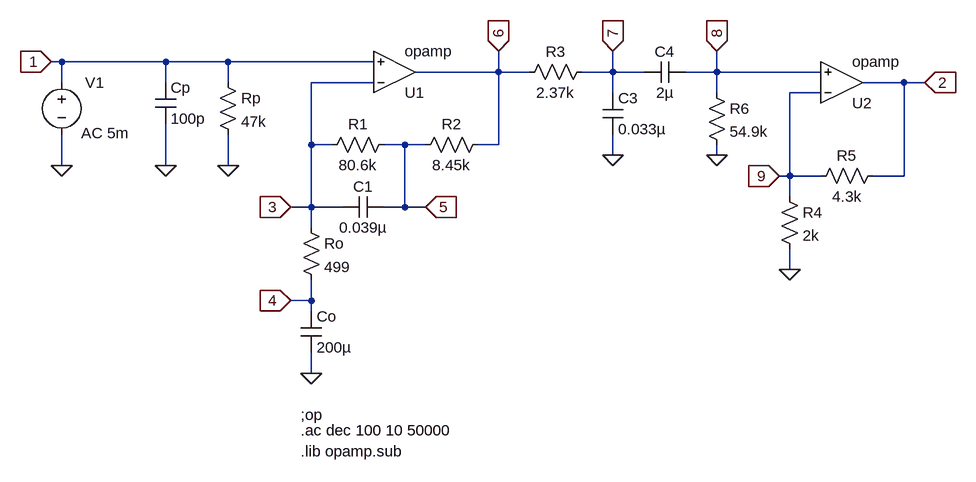
[diagram p0: schematic Two amplifier RIAA Phone Preamp v2.asc]
Two amplifier RIAA Phone Preamp v2.asc, the LTspice schematic file:
Version 4
SHEET 1 1876 1124
WIRE -272 176 -288 176
WIRE -112 176 -272 176
WIRE -16 176 -112 176
WIRE 208 176 -16 176
WIRE 400 192 400 160
WIRE 400 192 272 192
WIRE 448 192 400 192
WIRE 576 192 576 160
WIRE 576 192 528 192
WIRE 624 192 576 192
WIRE 736 192 736 160
WIRE 736 192 688 192
WIRE 896 192 736 192
WIRE -272 208 -272 176
WIRE -112 208 -112 176
WIRE -16 208 -16 176
WIRE 208 208 112 208
WIRE 1024 208 960 208
WIRE 1056 208 1024 208
WIRE 576 224 576 192
WIRE 736 224 736 192
WIRE 896 224 848 224
WIRE 112 304 112 208
WIRE 144 304 112 304
WIRE 256 304 224 304
WIRE 288 304 256 304
WIRE 400 304 400 192
WIRE 400 304 368 304
WIRE 576 320 576 288
WIRE 736 320 736 304
WIRE -272 336 -272 288
WIRE -112 336 -112 272
WIRE -16 336 -16 288
WIRE 848 352 848 224
WIRE 848 352 832 352
WIRE 896 352 848 352
WIRE 1024 352 1024 208
WIRE 1024 352 976 352
WIRE 848 384 848 352
WIRE 112 400 112 304
WIRE 112 400 80 400
WIRE 160 400 112 400
WIRE 256 400 256 304
WIRE 256 400 224 400
WIRE 288 400 256 400
WIRE 112 432 112 400
WIRE 848 496 848 464
WIRE 112 544 112 512
WIRE 112 544 80 544
WIRE 112 560 112 544
WIRE 112 656 112 624
FLAG -272 336 0
FLAG 112 656 0
FLAG -288 176 1
IOPIN -288 176 In
FLAG 80 400 3
IOPIN 80 400 In
FLAG 80 544 4
IOPIN 80 544 In
FLAG 288 400 5
IOPIN 288 400 In
FLAG 400 160 6
IOPIN 400 160 In
FLAG -112 336 0
FLAG -16 336 0
FLAG 576 320 0
FLAG 736 320 0
FLAG 848 496 0
FLAG 576 160 7
IOPIN 576 160 In
FLAG 736 160 8
IOPIN 736 160 In
FLAG 832 352 9
IOPIN 832 352 In
FLAG 1056 208 2
IOPIN 1056 208 In
SYMBOL voltage -272 192 R0
WINDOW 3 24 44 Left 2
WINDOW 123 30 94 Left 2
WINDOW 0 36 16 Left 2
WINDOW 39 0 0 Left 2
SYMATTR Value ""
SYMATTR Value2 AC 5m
SYMATTR InstName V1
SYMBOL cap 160 416 R270
WINDOW 0 32 32 VTop 2
WINDOW 3 0 32 VBottom 2
SYMATTR InstName C1
SYMATTR Value 0.039µ
SYMBOL cap 96 560 R0
SYMATTR InstName Co
SYMATTR Value 200µ
SYMBOL res 96 416 R0
SYMATTR InstName Ro
SYMATTR Value 499
SYMBOL res 432 208 R270
WINDOW 0 32 56 VTop 2
WINDOW 3 0 56 VBottom 2
SYMATTR InstName R3
SYMATTR Value 2.37k
SYMBOL res 128 320 R270
WINDOW 0 32 56 VTop 2
WINDOW 3 0 56 VBottom 2
SYMATTR InstName R1
SYMATTR Value 80.6k
SYMBOL res 272 320 R270
WINDOW 0 32 56 VTop 2
WINDOW 3 0 56 VBottom 2
SYMATTR InstName R2
SYMATTR Value 8.45k
SYMBOL cap -128 208 R0
SYMATTR InstName Cp
SYMATTR Value 100p
SYMBOL res -32 192 R0
SYMATTR InstName Rp
SYMATTR Value 47k
SYMBOL cap 560 224 R0
SYMATTR InstName C3
SYMATTR Value 0.033µ
SYMBOL cap 688 176 R90
WINDOW 0 0 32 VBottom 2
WINDOW 3 32 32 VTop 2
SYMATTR InstName C4
SYMATTR Value 2µ
SYMBOL res 720 208 R0
SYMATTR InstName R6
SYMATTR Value 54.9k
SYMBOL res 832 368 R0
SYMATTR InstName R4
SYMATTR Value 2k
SYMBOL res 992 336 R90
WINDOW 0 0 56 VBottom 2
WINDOW 3 32 56 VTop 2
SYMATTR InstName R5
SYMATTR Value 4.3k
SYMBOL OpAmps\\opamp 240 256 M180
SYMATTR InstName U1
SYMBOL OpAmps\\opamp 928 272 M180
SYMATTR InstName U2
TEXT 96 720 Left 2 !;op
TEXT 96 744 Left 2 !.ac dec 100 10 50000
TEXT 96 776 Left 2 !.lib opamp.sub

The netlist it stands for:
* Two amplifier RIAA Phone Preamp v2.asc
V1 1 0 AC 5m
C1 3 5 0.039µ
Co 4 0 200µ
Ro 3 4 499
R3 6 7 2.37k
R1 3 5 80.6k
R2 5 6 8.45k
Cp 1 0 100p
Rp 1 0 47k
C3 7 0 0.033µ
C4 8 7 2µ
R6 8 0 54.9k
R4 9 0 2k
R5 2 9 4.3k
XU1 3 1 6 opamp Aol=100K GBW=10Meg  ; pins invin noninvin out
XU2 9 8 2 opamp Aol=100K GBW=10Meg  ; pins invin noninvin out
;op
.ac dec 100 10 50000
.lib opamp.sub
.backanno
.end